# Altium schematic sheet Siwa_PCB.SchDoc
size A0; SheetNumber: 1; SheetTotal: 1
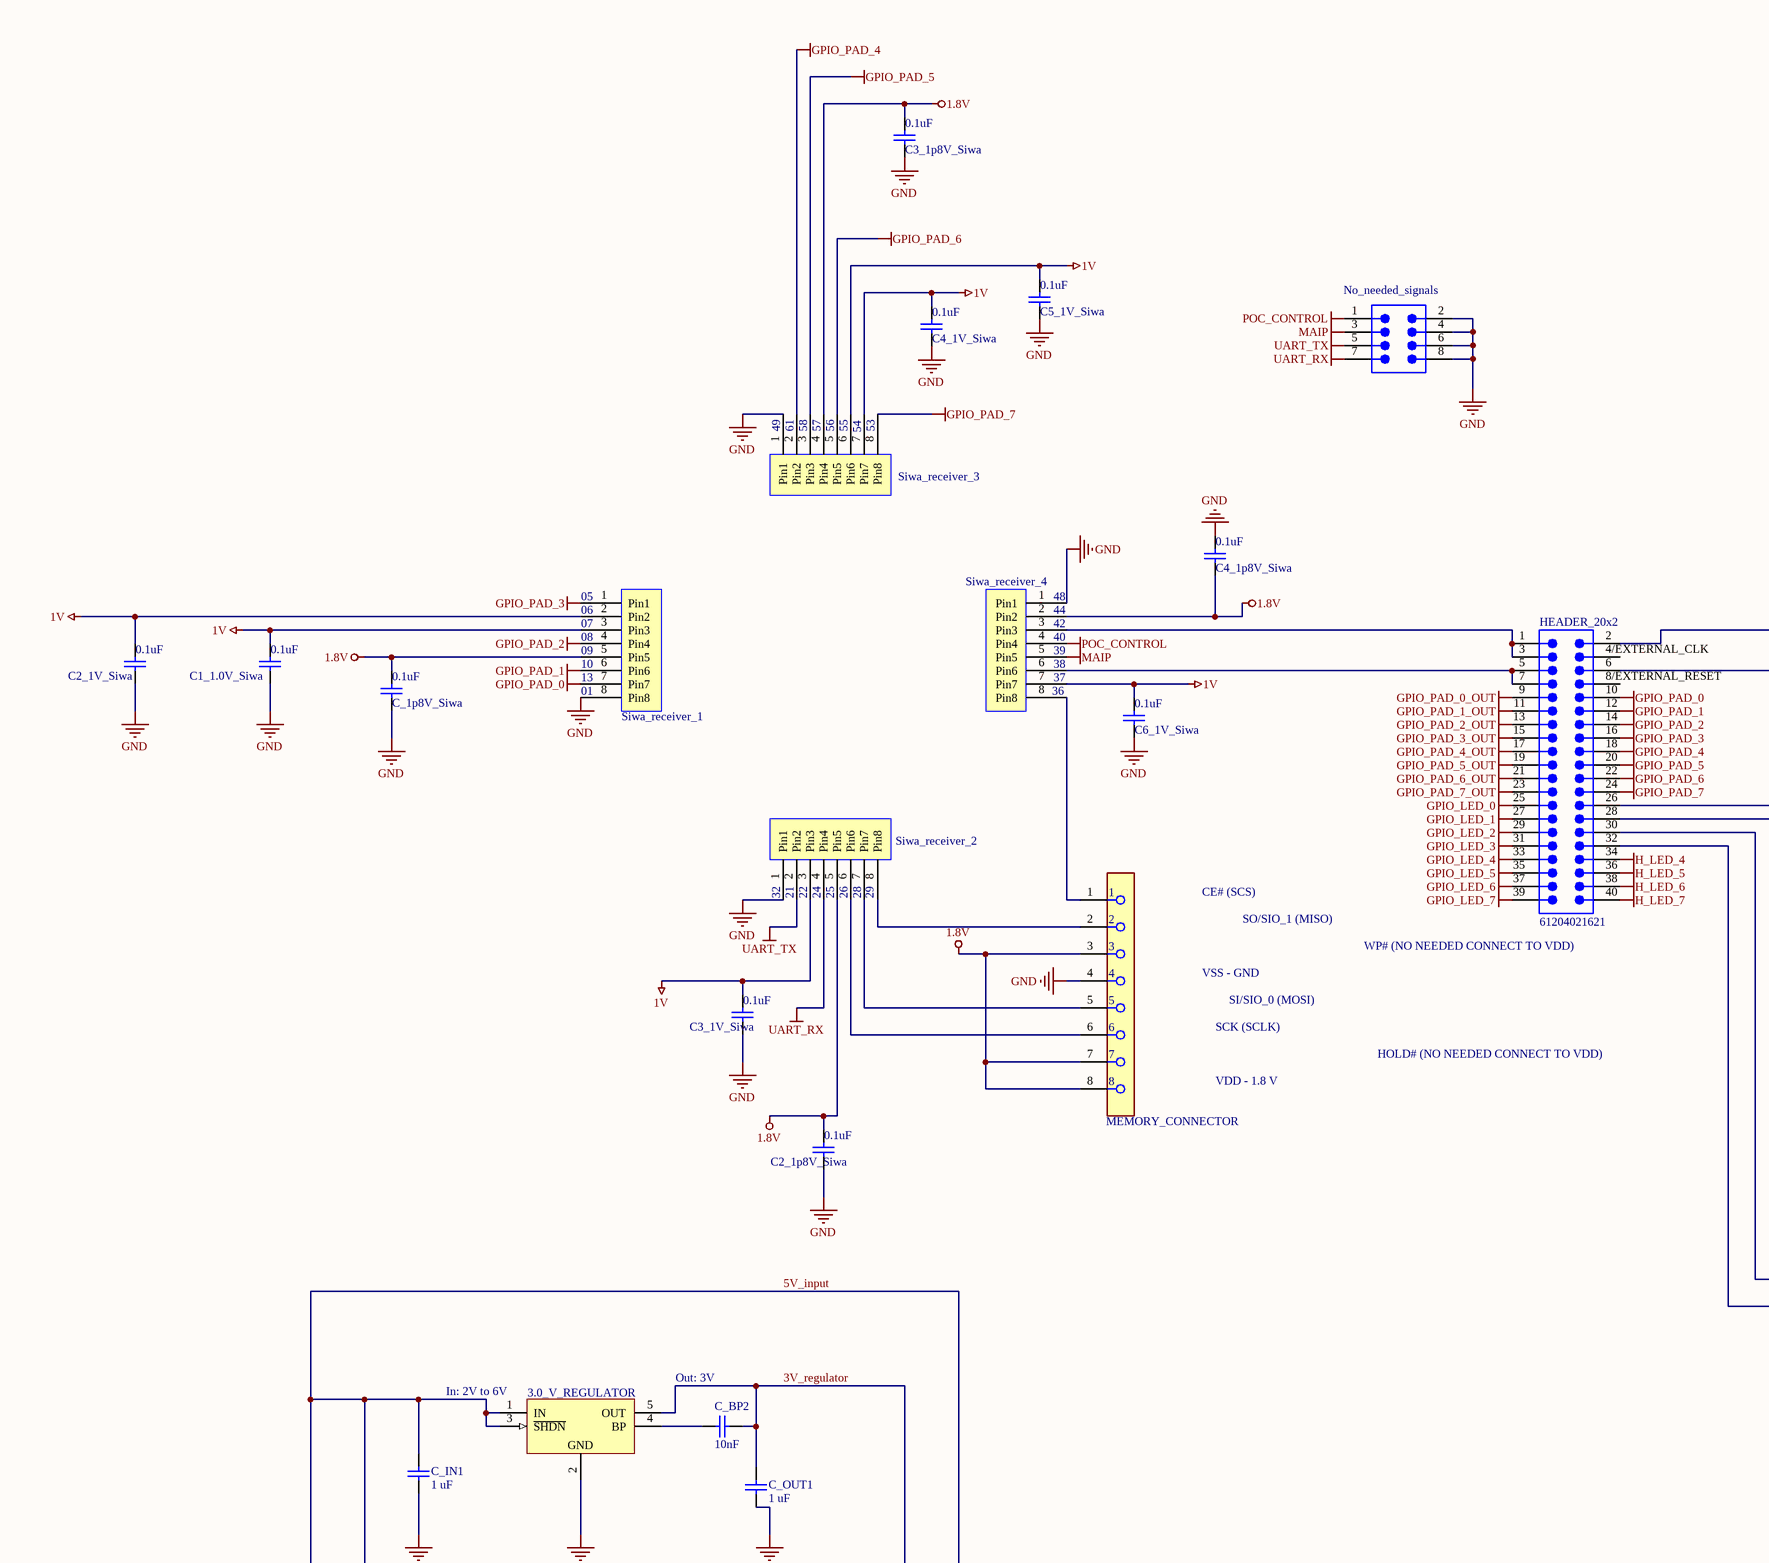
[diagram p0: Siwa_PCB.SchDoc, top left]
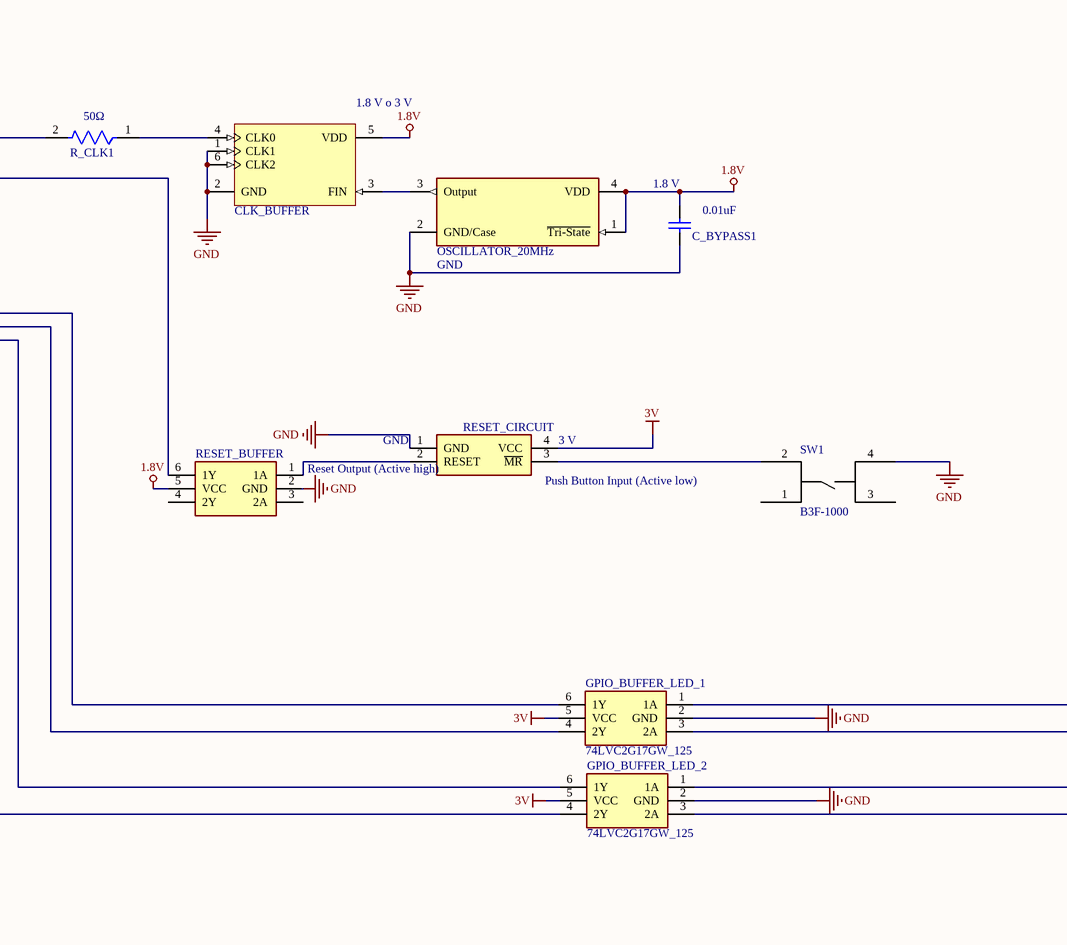
[diagram p1: Siwa_PCB.SchDoc, top right]
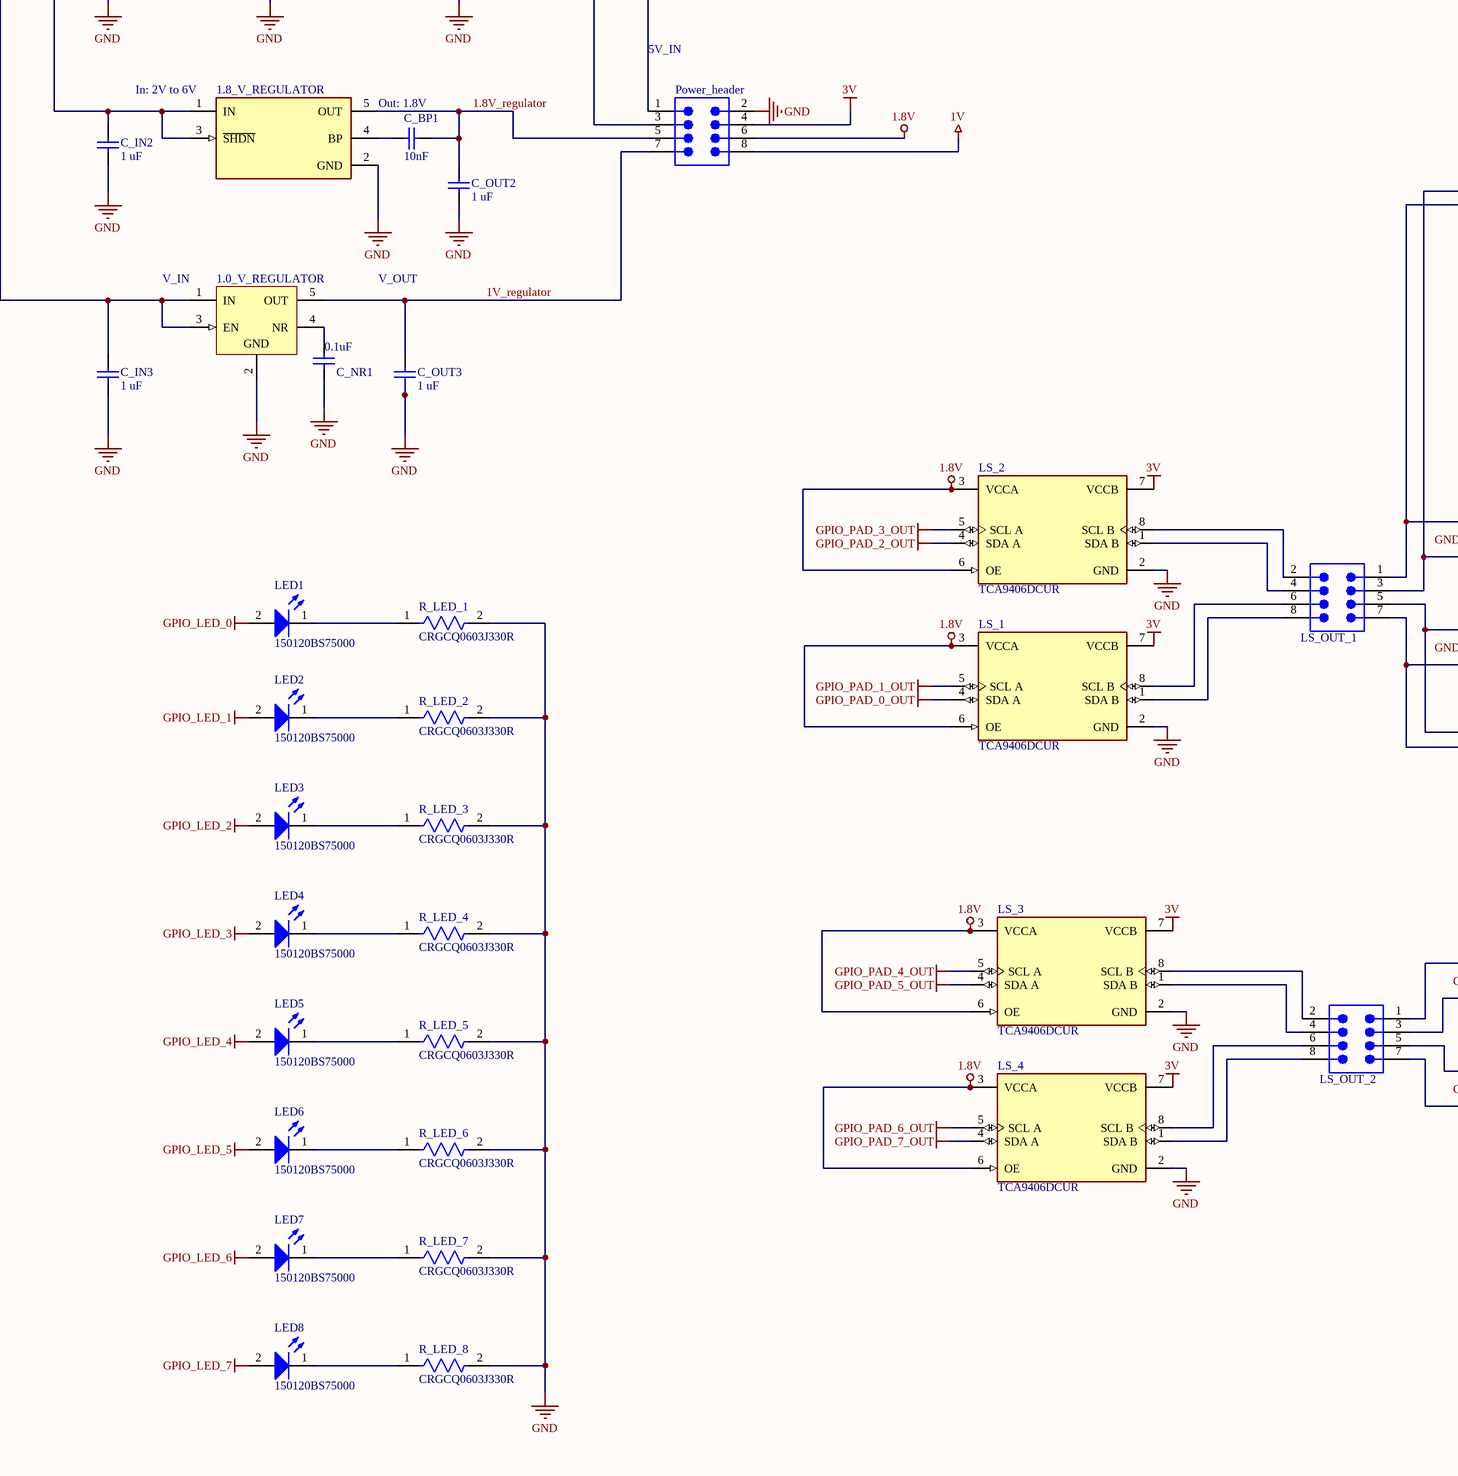
[diagram p2: Siwa_PCB.SchDoc, bottom left]
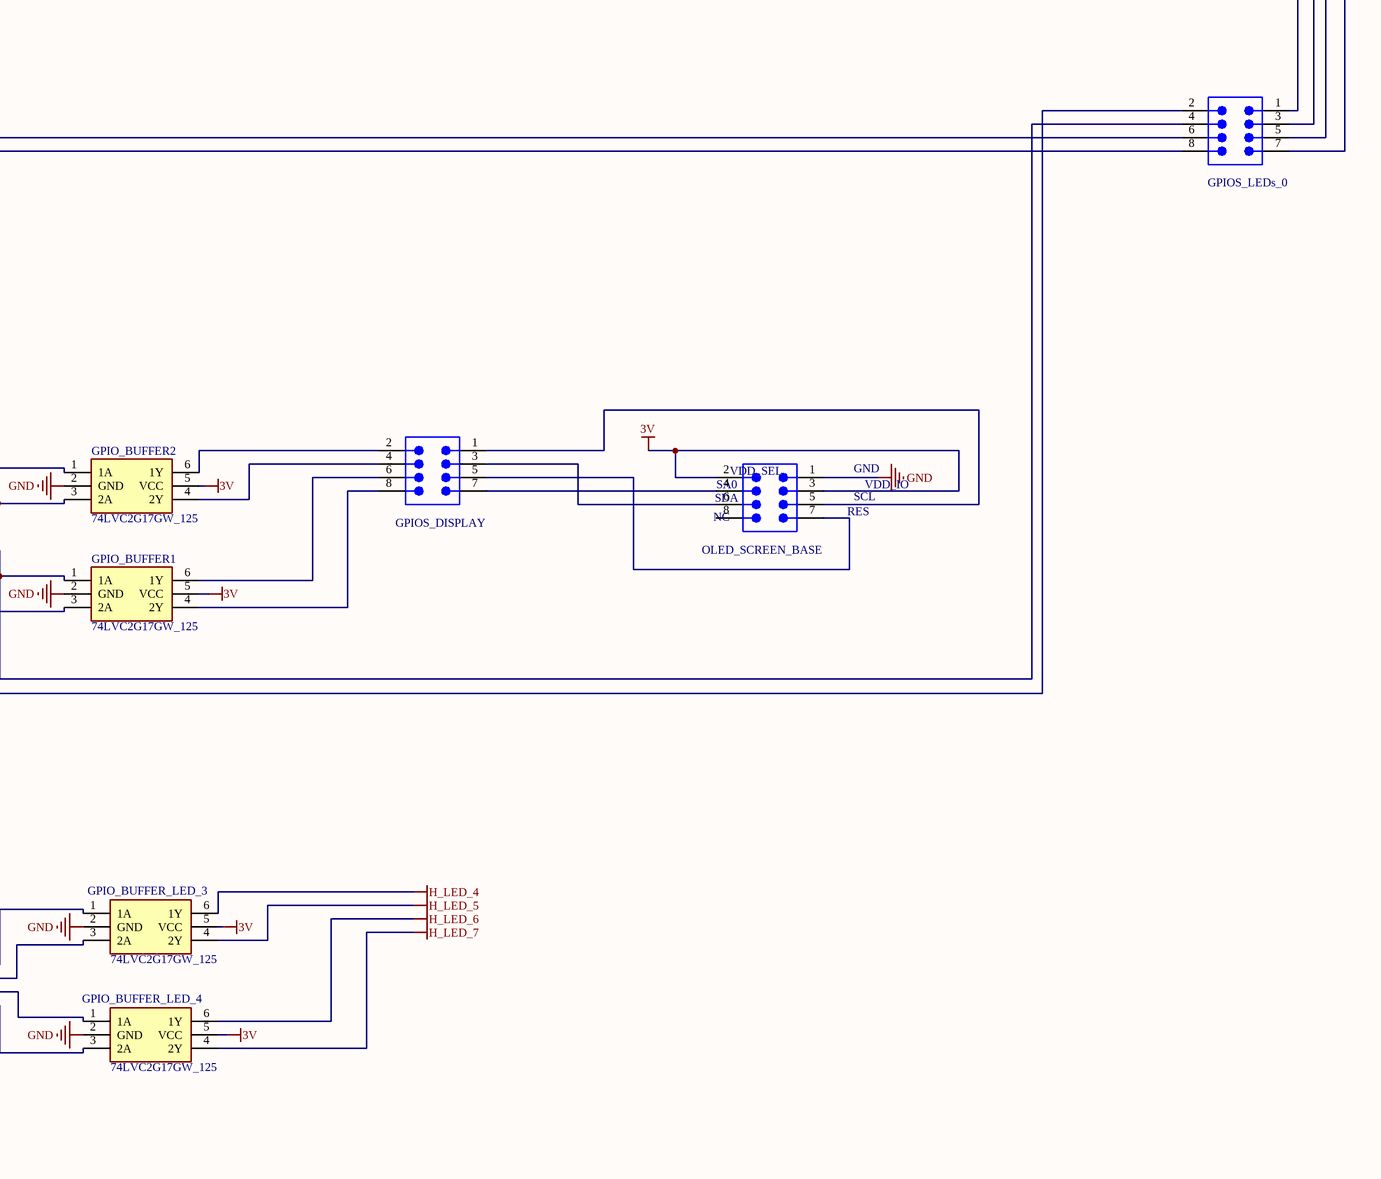
[diagram p3: Siwa_PCB.SchDoc, bottom right]

## Parts
1.0_V_REGULATOR  TPS71710DCKT  [DCK0005A_M]  (value not drawn)
1.8_V_REGULATOR  MAX8510EXK18+T  [FP-X5-1-MFG]  (value not drawn)
3.0_V_REGULATOR  MAX8510EXK30+T  [X5-1_N]  (value not drawn)
C1_1.0V_Siwa  0.1uF  [CAPC1608X92X38NL15T08]
C2_1p8V_Siwa  0.1uF  [CAPC1608X92X38NL15T08]
C2_1V_Siwa  0.1uF  [CAPC1608X92X38NL15T08]
C3_1p8V_Siwa  0.1uF  [CAPC1608X92X38NL15T08]
C3_1V_Siwa  0.1uF  [CAPC1608X92X38NL15T08]
C4_1p8V_Siwa  0.1uF  [CAPC1608X92X38NL15T08]
C4_1V_Siwa  0.1uF  [CAPC1608X92X38NL15T08]
C5_1V_Siwa  0.1uF  [CAPC1608X92X38NL15T08]
C6_1V_Siwa  0.1uF  [CAPC1608X92X38NL15T08]
C_1p8V_Siwa  0.1uF  [CAPC1608X92X38NL15T08]
C_BP1  10nF  [CAPC1608X92X38LL15T08]
C_BP2  10nF  [CAPC1608X92X38LL15T08]
C_BYPASS1  0.01uF  [CAPC1608X92X38NL15T08]
C_IN1  1 uF  [CAPC1608X90X35LL15T15]
C_IN2  1 uF  [CAPC1608X90X35LL15T15]
C_IN3  1 uF  [CAPC1608X90X35LL15T15]
C_NR1  0.1uF  [CAPC1608X92X38NL15T08]
C_OUT1  1 uF  [CAPC1608X90X35LL15T15]
C_OUT2  1 uF  [CAPC1608X90X35LL15T15]
C_OUT3  1 uF  [CAPC1608X90X35LL15T15]
CLK_BUFFER  PL133-37TI  [FP-SOT23-6LD-PL-1-MFG]  (value not drawn)
GPIO_BUFFER1  74LVC2G17GW_125  [SOT65P210X110-6N]
GPIO_BUFFER2  74LVC2G17GW_125  [SOT65P210X110-6N]
GPIO_BUFFER_LED_1  74LVC2G17GW_125  [SOT65P210X110-6N]
GPIO_BUFFER_LED_2  74LVC2G17GW_125  [SOT65P210X110-6N]
GPIO_BUFFER_LED_3  74LVC2G17GW_125  [SOT65P210X110-6N]
GPIO_BUFFER_LED_4  74LVC2G17GW_125  [SOT65P210X110-6N]
GPIOS_DISPLAY  61200821621  [61200821621]  (value not drawn)
GPIOS_LEDs_0  61200821621  [61200821621]  (value not drawn)
HEADER_20x2  61204021621  [61204021621]
LED1  150120BS75000  [WL-SMCW_1206_150120xx75000]
LED2  150120BS75000  [WL-SMCW_1206_150120xx75000]
LED3  150120BS75000  [WL-SMCW_1206_150120xx75000]
LED4  150120BS75000  [WL-SMCW_1206_150120xx75000]
LED5  150120BS75000  [WL-SMCW_1206_150120xx75000]
LED6  150120BS75000  [WL-SMCW_1206_150120xx75000]
LED7  150120BS75000  [WL-SMCW_1206_150120xx75000]
LED8  150120BS75000  [WL-SMCW_1206_150120xx75000]
LS_1  TCA9406DCUR  [FP-DCU0008A-IPC_B]
LS_2  TCA9406DCUR  [FP-DCU0008A-IPC_B]
LS_3  TCA9406DCUR  [FP-DCU0008A-IPC_B]
LS_4  TCA9406DCUR  [FP-DCU0008A-IPC_B]
LS_OUT_1  61200821621  [61200821621]  (value not drawn)
LS_OUT_2  61200821621  [61200821621]  (value not drawn)
MEMORY_CONNECTOR  DIP8_base  [FP-1-2199298-2-MFG]  (value not drawn)
No_needed_signals  61200821621  [61200821621]  (value not drawn)
OLED_SCREEN_BASE  61200821621  [61200821621]  (value not drawn)
OSCILLATOR_20MHz  ASE3-20.000MHZ-KT  [FP-ASE3-MFG]  (value not drawn)
Power_header  61200821621  [61200821621]  (value not drawn)
R_CLK1  50Ω  [FP-D12-CRCW0805-MFG]
R_LED_1  CRGCQ0603J330R  [FP-CRGCQ0603-IPC_C]
R_LED_2  CRGCQ0603J330R  [FP-CRGCQ0603-IPC_C]
R_LED_3  CRGCQ0603J330R  [FP-CRGCQ0603-IPC_C]
R_LED_4  CRGCQ0603J330R  [FP-CRGCQ0603-IPC_C]
R_LED_5  CRGCQ0603J330R  [FP-CRGCQ0603-IPC_C]
R_LED_6  CRGCQ0603J330R  [FP-CRGCQ0603-IPC_C]
R_LED_7  CRGCQ0603J330R  [FP-CRGCQ0603-IPC_C]
R_LED_8  CRGCQ0603J330R  [FP-CRGCQ0603-IPC_C]
RESET_BUFFER  74LVC2G17GW_125  [SOT65P210X110-6N]  (value not drawn)
RESET_CIRCUIT  APX812-29UG-7  [APX81229UG7]  (value not drawn)
Siwa_receiver_1  HEADER 8P 2.54mm  [PPTC081LFBN-RC]  (value not drawn)
Siwa_receiver_2  HEADER 8P 2.54mm  [PPTC081LFBN-RC]  (value not drawn)
Siwa_receiver_3  HEADER 8P 2.54mm  [PPTC081LFBN-RC]  (value not drawn)
Siwa_receiver_4  HEADER 8P 2.54mm  [PPTC081LFBN-RC]  (value not drawn)
SW1  B3F-1000  [PCBComponent_1]

## Nets
1.8V: C2_1p8V_Siwa.2 C3_1p8V_Siwa.2 C4_1p8V_Siwa.1 C_1p8V_Siwa.2 C_BYPASS1.2 CLK_BUFFER.5(VDD) LS_1.3(VCCA) LS_1.6(OE) LS_2.3(VCCA) LS_2.6(OE) LS_3.3(VCCA) LS_3.6(OE) LS_4.3(VCCA) LS_4.6(OE) MEMORY_CONNECTOR.3 MEMORY_CONNECTOR.7 MEMORY_CONNECTOR.8 OSCILLATOR_20MHz.1(~{Tri-State}) OSCILLATOR_20MHz.4(VDD) Power_header.6 RESET_BUFFER.5(VCC) Siwa_receiver_1.5(Pin5) Siwa_receiver_2.5(Pin5) Siwa_receiver_3.4(Pin4) Siwa_receiver_4.2(Pin2)
1V: C1_1.0V_Siwa.2 C2_1V_Siwa.2 C3_1V_Siwa.2 C4_1V_Siwa.2 C5_1V_Siwa.2 C6_1V_Siwa.2 Power_header.8 Siwa_receiver_1.2(Pin2) Siwa_receiver_1.3(Pin3) Siwa_receiver_2.3(Pin3) Siwa_receiver_3.6(Pin6) Siwa_receiver_3.7(Pin7) Siwa_receiver_4.7(Pin7)
3V: GPIO_BUFFER1.5(VCC) GPIO_BUFFER2.5(VCC) GPIO_BUFFER_LED_1.5(VCC) GPIO_BUFFER_LED_2.5(VCC) GPIO_BUFFER_LED_3.5(VCC) GPIO_BUFFER_LED_4.5(VCC) LS_1.7(VCCB) LS_2.7(VCCB) LS_3.7(VCCB) LS_4.7(VCCB) OLED_SCREEN_BASE.2 OLED_SCREEN_BASE.3 Power_header.4 RESET_CIRCUIT.4(VCC)
GND: 1.0_V_REGULATOR.2(GND) 1.8_V_REGULATOR.2(GND) 3.0_V_REGULATOR.2(GND) C1_1.0V_Siwa.1 C2_1p8V_Siwa.1 C2_1V_Siwa.1 C3_1p8V_Siwa.1 C3_1V_Siwa.1 C4_1p8V_Siwa.2 C4_1V_Siwa.1 C5_1V_Siwa.1 C6_1V_Siwa.1 C_1p8V_Siwa.1 C_BYPASS1.1 C_IN1.1 C_IN2.1 C_IN3.1 C_NR1.1 C_OUT1.1 C_OUT2.1 C_OUT3.1 CLK_BUFFER.1(CLK1) CLK_BUFFER.2(GND) CLK_BUFFER.6(CLK2) GPIO_BUFFER1.2(GND) GPIO_BUFFER2.2(GND) GPIO_BUFFER_LED_1.2(GND) GPIO_BUFFER_LED_2.2(GND) GPIO_BUFFER_LED_3.2(GND) GPIO_BUFFER_LED_4.2(GND) LS_1.2(GND) LS_2.2(GND) LS_3.2(GND) LS_4.2(GND) MEMORY_CONNECTOR.4 No_needed_signals.2 No_needed_signals.4 No_needed_signals.6 No_needed_signals.8 OLED_SCREEN_BASE.1 OSCILLATOR_20MHz.2(GND/Case) Power_header.2 R_LED_1.2 R_LED_2.2 R_LED_3.2 R_LED_4.2 R_LED_5.2 R_LED_6.2 R_LED_7.2 R_LED_8.2 RESET_BUFFER.2(GND) RESET_CIRCUIT.1(GND) Siwa_receiver_1.8(Pin8) Siwa_receiver_2.1(Pin1) Siwa_receiver_3.1(Pin1) Siwa_receiver_4.1(Pin1) SW1.4(P4)
GPIO_LED_0: HEADER_20x2.25 LED1.2(A)
GPIO_LED_1: HEADER_20x2.27 LED2.2(A)
GPIO_LED_2: HEADER_20x2.29 LED3.2(A)
GPIO_LED_3: HEADER_20x2.31 LED4.2(A)
GPIO_LED_4: HEADER_20x2.33 LED5.2(A)
GPIO_LED_5: HEADER_20x2.35 LED6.2(A)
GPIO_LED_6: HEADER_20x2.37 LED7.2(A)
GPIO_LED_7: HEADER_20x2.39 LED8.2(A)
GPIO_PAD_0: HEADER_20x2.10 Siwa_receiver_1.7(Pin7)
GPIO_PAD_0_OUT: HEADER_20x2.9 LS_1.4(SDA_A)
GPIO_PAD_1: HEADER_20x2.12 Siwa_receiver_1.6(Pin6)
GPIO_PAD_1_OUT: HEADER_20x2.11 LS_1.5(SCL_A)
GPIO_PAD_2: HEADER_20x2.14 Siwa_receiver_1.4(Pin4)
GPIO_PAD_2_OUT: HEADER_20x2.13 LS_2.4(SDA_A)
GPIO_PAD_3: HEADER_20x2.16 Siwa_receiver_1.1(Pin1)
GPIO_PAD_3_OUT: HEADER_20x2.15 LS_2.5(SCL_A)
GPIO_PAD_4: HEADER_20x2.18 Siwa_receiver_3.2(Pin2)
GPIO_PAD_4_OUT: HEADER_20x2.17 LS_3.5(SCL_A)
GPIO_PAD_5: HEADER_20x2.20 Siwa_receiver_3.3(Pin3)
GPIO_PAD_5_OUT: HEADER_20x2.19 LS_3.4(SDA_A)
GPIO_PAD_6: HEADER_20x2.22 Siwa_receiver_3.5(Pin5)
GPIO_PAD_6_OUT: HEADER_20x2.21 LS_4.5(SCL_A)
GPIO_PAD_7: HEADER_20x2.24 Siwa_receiver_3.8(Pin8)
GPIO_PAD_7_OUT: HEADER_20x2.23 LS_4.4(SDA_A)
H_LED_4: GPIO_BUFFER_LED_3.6(1Y) HEADER_20x2.34
H_LED_5: GPIO_BUFFER_LED_3.4(2Y) HEADER_20x2.36
H_LED_6: GPIO_BUFFER_LED_4.6(1Y) HEADER_20x2.38
H_LED_7: GPIO_BUFFER_LED_4.4(2Y) HEADER_20x2.40
MAIP: No_needed_signals.3 Siwa_receiver_4.5(Pin5)
POC_CONTROL: No_needed_signals.1 Siwa_receiver_4.4(Pin4)
UART_RX: No_needed_signals.7 Siwa_receiver_2.4(Pin4)
UART_TX: No_needed_signals.5 Siwa_receiver_2.2(Pin2)
1.8V_regulator: 1.8_V_REGULATOR.5(OUT) C_BP1.2 C_OUT2.2 Power_header.5
1V_regulator: 1.0_V_REGULATOR.5(OUT) C_OUT3.2 Power_header.7
3V_regulator: 3.0_V_REGULATOR.5(OUT) C_BP2.2 C_OUT1.2 Power_header.3
5V_input: 1.0_V_REGULATOR.1(IN) 1.0_V_REGULATOR.3(EN) 1.8_V_REGULATOR.1(IN) 1.8_V_REGULATOR.3(~{SHDN}) 3.0_V_REGULATOR.1(IN) 3.0_V_REGULATOR.3(~{SHDN}) C_IN1.2 C_IN2.2 C_IN3.2 Power_header.1
Net1.0_V_REGULATOR_4: 1.0_V_REGULATOR.4(NR) C_NR1.2
Net1.8_V_REGULATOR_4: 1.8_V_REGULATOR.4(BP) C_BP1.1
Net3.0_V_REGULATOR_4: 3.0_V_REGULATOR.4(BP) C_BP2.1
NetCLK_BUFFER_3: CLK_BUFFER.3(FIN) OSCILLATOR_20MHz.3(Output)
NetCLK_BUFFER_4: CLK_BUFFER.4(CLK0) R_CLK1.1
NetGPIO_BUFFER1_1: GPIO_BUFFER1.1(1A) GPIOS_LEDs_0.4 LS_OUT_1.5
NetGPIO_BUFFER1_3: GPIO_BUFFER1.3(2A) GPIOS_LEDs_0.2 LS_OUT_1.7
NetGPIO_BUFFER1_4: GPIO_BUFFER1.4(2Y) GPIOS_DISPLAY.8
NetGPIO_BUFFER1_6: GPIO_BUFFER1.6(1Y) GPIOS_DISPLAY.6
NetGPIO_BUFFER2_1: GPIO_BUFFER2.1(1A) GPIOS_LEDs_0.8 LS_OUT_1.1
NetGPIO_BUFFER2_3: GPIO_BUFFER2.3(2A) GPIOS_LEDs_0.6 LS_OUT_1.3
NetGPIO_BUFFER2_4: GPIO_BUFFER2.4(2Y) GPIOS_DISPLAY.4
NetGPIO_BUFFER2_6: GPIO_BUFFER2.6(1Y) GPIOS_DISPLAY.2
NetGPIO_BUFFER_LED_1_1: GPIO_BUFFER_LED_1.1(1A) GPIOS_LEDs_0.1
NetGPIO_BUFFER_LED_1_3: GPIO_BUFFER_LED_1.3(2A) GPIOS_LEDs_0.3
NetGPIO_BUFFER_LED_1_4: GPIO_BUFFER_LED_1.4(2Y) HEADER_20x2.28
NetGPIO_BUFFER_LED_1_6: GPIO_BUFFER_LED_1.6(1Y) HEADER_20x2.26
NetGPIO_BUFFER_LED_2_1: GPIO_BUFFER_LED_2.1(1A) GPIOS_LEDs_0.5
NetGPIO_BUFFER_LED_2_3: GPIO_BUFFER_LED_2.3(2A) GPIOS_LEDs_0.7
NetGPIO_BUFFER_LED_2_4: GPIO_BUFFER_LED_2.4(2Y) HEADER_20x2.32
NetGPIO_BUFFER_LED_2_6: GPIO_BUFFER_LED_2.6(1Y) HEADER_20x2.30
NetGPIO_BUFFER_LED_3_1: GPIO_BUFFER_LED_3.1(1A) LS_OUT_2.1
NetGPIO_BUFFER_LED_3_3: GPIO_BUFFER_LED_3.3(2A) LS_OUT_2.3
NetGPIO_BUFFER_LED_4_1: GPIO_BUFFER_LED_4.1(1A) LS_OUT_2.5
NetGPIO_BUFFER_LED_4_3: GPIO_BUFFER_LED_4.3(2A) LS_OUT_2.7
NetGPIOS_DISPLAY_1: GPIOS_DISPLAY.1 OLED_SCREEN_BASE.5
NetGPIOS_DISPLAY_3: GPIOS_DISPLAY.3 OLED_SCREEN_BASE.6
NetGPIOS_DISPLAY_5: GPIOS_DISPLAY.5 OLED_SCREEN_BASE.7
NetGPIOS_DISPLAY_7: GPIOS_DISPLAY.7 OLED_SCREEN_BASE.4
NetHEADER_20x2_1: HEADER_20x2.1 HEADER_20x2.3 Siwa_receiver_4.3(Pin3)
NetHEADER_20x2_2: HEADER_20x2.2 R_CLK1.2
NetHEADER_20x2_5: HEADER_20x2.5 HEADER_20x2.7 Siwa_receiver_4.6(Pin6)
NetHEADER_20x2_6: HEADER_20x2.6 RESET_BUFFER.6(1Y)
NetLED1_1: LED1.1(K) R_LED_1.1
NetLED2_1: LED2.1(K) R_LED_2.1
NetLED3_1: LED3.1(K) R_LED_3.1
NetLED4_1: LED4.1(K) R_LED_4.1
NetLED5_1: LED5.1(K) R_LED_5.1
NetLED6_1: LED6.1(K) R_LED_6.1
NetLED7_1: LED7.1(K) R_LED_7.1
NetLED8_1: LED8.1(K) R_LED_8.1
NetLS_1_1: LS_1.1(SDA_B) LS_OUT_1.8
NetLS_1_8: LS_1.8(SCL_B) LS_OUT_1.6
NetLS_2_1: LS_2.1(SDA_B) LS_OUT_1.4
NetLS_2_8: LS_2.8(SCL_B) LS_OUT_1.2
NetLS_3_1: LS_3.1(SDA_B) LS_OUT_2.4
NetLS_3_8: LS_3.8(SCL_B) LS_OUT_2.2
NetLS_4_1: LS_4.1(SDA_B) LS_OUT_2.8
NetLS_4_8: LS_4.8(SCL_B) LS_OUT_2.6
NetMEMORY_CONNECTOR_1: MEMORY_CONNECTOR.1 Siwa_receiver_4.8(Pin8)
NetMEMORY_CONNECTOR_2: MEMORY_CONNECTOR.2 Siwa_receiver_2.8(Pin8)
NetMEMORY_CONNECTOR_5: MEMORY_CONNECTOR.5 Siwa_receiver_2.7(Pin7)
NetMEMORY_CONNECTOR_6: MEMORY_CONNECTOR.6 Siwa_receiver_2.6(Pin6)
NetRESET_BUFFER_1: RESET_BUFFER.1(1A) RESET_CIRCUIT.2(RESET)
NetRESET_CIRCUIT_3: RESET_CIRCUIT.3(~{MR}) SW1.2(P2)

Not connected (* = marked no-connect by the designer): HEADER_20x2 4/EXTERNAL_CLK(4) 8/EXTERNAL_RESET(8); OLED_SCREEN_BASE 8; RESET_BUFFER 3(2A) 4(2Y); SW1 1(P1) 3(P3)

## Notes on the sheet
- (near Siwa_receiver_3) 49
- (near Siwa_receiver_3) 61
- (near Siwa_receiver_3) 58
- (near Siwa_receiver_3) 57
- (near Siwa_receiver_3) 56
- (near Siwa_receiver_3) 55
- (near Siwa_receiver_3) 54
- (near Siwa_receiver_3) 53
- (near Siwa_receiver_1) 05
- (near Siwa_receiver_4) 48
- (near CLK_BUFFER) 1.8 V o 3 V
- (near Siwa_receiver_1) 06
- (near Siwa_receiver_1) 07
- (near Siwa_receiver_1) 08
- (near Siwa_receiver_1) 09
- (near Siwa_receiver_1) 10
- (near Siwa_receiver_4) 44
- (near Siwa_receiver_4) 42
- (near Siwa_receiver_4) 40
- (near Siwa_receiver_4) 39
- (near Siwa_receiver_4) 38
- (near Siwa_receiver_1) 13
- (near Siwa_receiver_1) 01
- (near Siwa_receiver_4) 36
- (near Siwa_receiver_4) 37
- 1.8 V
- (near OSCILLATOR_20MHz) GND
- (near Siwa_receiver_2) 32
- (near Siwa_receiver_2) 21
- (near Siwa_receiver_2) 22
- (near Siwa_receiver_2) 24
- (near Siwa_receiver_2) 25
- (near Siwa_receiver_2) 26
- (near Siwa_receiver_2) 28
- (near Siwa_receiver_2) 29
- (near MEMORY_CONNECTOR) CE# (SCS)
- (near MEMORY_CONNECTOR) SO/SIO_1 (MISO)
- (near RESET_CIRCUIT) GND
- (near RESET_CIRCUIT) 3 V
- (near MEMORY_CONNECTOR) VSS - GND
- (near MEMORY_CONNECTOR) SI/SIO_0 (MOSI)
- WP# (NO NEEDED CONNECT TO VDD)
- (near RESET_CIRCUIT) Reset Output (Active high)
- (near RESET_CIRCUIT) Push Button Input (Active low)
- (near MEMORY_CONNECTOR) SCK (SCLK)
- HOLD# (NO NEEDED CONNECT TO VDD)
- (near MEMORY_CONNECTOR) VDD - 1.8 V
- (near 3.0_V_REGULATOR) In: 2V to 6V
- Out: 3V
- 5V_IN
- (near 1.8_V_REGULATOR) In: 2V to 6V
- Out: 1.8V
- (near 1.0_V_REGULATOR) V_IN
- V_OUT
- (near OLED_SCREEN_BASE) SDA
- (near OLED_SCREEN_BASE) SA0
- (near OLED_SCREEN_BASE) VDD_SEL
- (near OLED_SCREEN_BASE) GND
- (near OLED_SCREEN_BASE) SCL
- (near OLED_SCREEN_BASE) VDD_IO
- (near OLED_SCREEN_BASE) NC
- (near OLED_SCREEN_BASE) RES

## Library data of the parts
1.0_V_REGULATOR = CMP-0394-00843-2: Single Output High PSRR LDO, 150 mA, Fixed 1 V Output, 2.5 to 6.5 V Input, with Low IQ, 5-pin SC70 (DCK), -40 to 85 degC, Green (RoHS & no Sb/Br); Manufacturer: Texas Instruments; Fixed Output Options(V): 1; Iq(Typ)(mA): 0.05; Vdo(Typ)(mV): 170; Vin(Min)(V): 2.5; Vin(Max)(V): 6.5; Iout(Max)(A): 0.15; Accuracy(%): 3; SubFamily: Single Channel LDO; PackageReference: DCK0005A; Mounting Technology: Surface Mount; Vout Adj(Max)(V): 1; Eco-Plan: Green (RoHS & no Sb/Br); Vout Adj(Min)(V): 1; ComponentLink1URL: http://www.ti.com/; ComponentLink1Description: Manufacturer URL; ComponentLink2URL: http://www.ti.com/general/docs/lit/getliterature.tsp?genericPartNumber=TPS71710&fileType=pdf; ComponentLink3Description: Package Specification; ComponentLink3URL: http://www.ti.com/litv/pdf/mpds025f; Code_JEDEC: MO-203; DatasheetVersion: SBVS068G; ComponentLink2Description: Datasheet; PackageVersion: 4093553-3/G; PackageDescription: 5-Pin Plastic Small-Outline, Body 2 x 1.25 mm, Pitch 0.65 mm; PartNumber: TPS71710DCKT
1.8_V_REGULATOR = CMP-0246-00401-2: IC REG LINEAR 1.8V 120MA SC70-5; Accuracy: 2%; Number of Outputs: 1; Min Current Limit: 130mA; Max Input Voltage: 6V; Max Power Dissipation: 247mW; Output Configuration: Positive; Output Type: Fixed; Quiescent Current: 90uA; Reference Voltage: 1.225V; Min Input Voltage: 2V; Power Supply Rejection Ratio (PSRR): 54dB; Input Bias Current: 40uA; Output Current: 120mA; Nominal Output Voltage: 1.8V; Output Voltage: 1.8V; Series: -; Number of Regulators: 1; Packaging: Tape and Reel; Mount: Surface Mount; Case/Package: SC; Lead Free: Lead Free; RoHS Compliant: Yes; Number of Pins: 5; Package Quantity: 2500; Max Output Current: 120mA; Polarity: Positive; Min Operating Temperature: -40°C; Max Operating Temperature: 85°C
3.0_V_REGULATOR = CMP-0246-00522-1: Ultra-Low-Noise, High PSRR, Low-Dropout, 120mA Linear Regulator, 3V Out, 5-Pin SC70, -40°C to +85°C; ComponentLink1Description: Manufacturer URL; ComponentLink2URL: http://datasheets.maxim-ic.com/en/ds/MAX8510-MAX8512.pdf; PackageDescription: 5-Pin SC70 Transistor Package, 0.65 mm Pitch, 2.2 mm Lead Span; ComponentLink3Description: Package Specification; ComponentLink1URL: http://www.maxim-ic.com; ComponentLink3URL: http://pdfserv.maxim-ic.com/package_dwgs/21-0076.PDF; PackageVersion: revE, 2006; PackageReference: X5-1; Code_JEDEC: MO-203; ComponentLink2Description: Datasheet; DatasheetVersion: Rev 4, Aug-2011
C1_1.0V_Siwa C2_1p8V_Siwa C2_1V_Siwa C3_1p8V_Siwa C3_1V_Siwa C4_1p8V_Siwa C4_1V_Siwa C5_1V_Siwa C6_1V_Siwa C_1p8V_Siwa C_NR1 = CMP-2006-01166-1: Manufacturer: Vitramon; Part Number: VJ0603Y104KXXAP
C_BP1 C_BP2 = CMP-2006-01201-1: Manufacturer: Vitramon; Part Number: VJ0603Y103JXXAC
C_BYPASS1 = CMP-2006-01149-1: Manufacturer: Vitramon; Part Number: VJ0603Y103KXAAP
C_IN1-C_IN3 C_OUT1-C_OUT3 = CMP-2006-04542-1: Manufacturer: AVX Interconnect / Elco; Part Number: 0603YG105ZAT2A
CLK_BUFFER = CMP-00252-66952958-1: PL133-37TI LVCMOS Sine Wave PL133 SOT-23-6 R-PDSO-G6 clock driver 0.95mm 1.62V~3.63V 150MHz -40C~85C; Number of Circuits: 1; Logic Function: Inverting; Min Supply Voltage: 1.62V; Max Supply Voltage: 3.63V; Number of Outputs: 3; Lifecycle Status: Production; Max Frequency: 150MHz; Schedule B: 8542390000, 8542390000; Mount: Surface Mount; Max Operating Temperature: 85°C; Number of Elements: 1; Lead Free: Lead Free; RoHS: Compliant; Min Operating Temperature: -40°C; Number of Inputs: 1; Input: LVCMOS; Height: 1.45mm
GPIO_BUFFER1 GPIO_BUFFER2 GPIO_BUFFER_LED_1-GPIO_BUFFER_LED_4 RESET_BUFFER = 74LVC2G17GW_125: NXP 74LVC2G17GW,125, Dual Non-Inverting Schmitt Trigger Single Ended Buffer, 1.65  5.5 V, 6-Pin SC-88; Manufacturer_Name: Nexperia; Geometry.Height: 1.1mm; Manufacturer_Part_Number: 74LVC2G17GW,125; Mouser Part Number: 771-LVC2G17GW125; Mouser Price/Stock: https://www.mouser.co.uk/ProductDetail/Nexperia/74LVC2G17GW125?qs=me8TqzrmIYUC6E0%2FnH98oA%3D%3D; Arrow Part Number: 74LVC2G17GW,125; Arrow Price/Stock: https://www.arrow.com/en/products/74lvc2g17gw125/nexperia?utm_currency=USD&region=nac; Datasheet Link: https://assets.nexperia.com/documents/data-sheet/74LVC2G17.pdf
GPIOS_DISPLAY GPIOS_LEDs_0 LS_OUT_1 LS_OUT_2 No_needed_signals OLED_SCREEN_BASE Power_header = CMP-1502-00006-3: Wr-bhd; 2.54MM Pitch 8 Way 2 Row Shrouded Straight Pcb Header, Surface Mount; Number of Contacts: 8; Operating Supply Voltage: 250V; Gender: Male; Current Rating: 3A; Contact Resistance: 20mΩ; Connector Type: Male Pin; Insulation Resistance: 1GΩ; Pitch: 2.54mm; RoHS: Compliant; Row Spacing: 2.54mm; Color: Black; Termination: Solder; Min Operating Temperature: -40°C; Number of Rows: 2; Number of Positions: 8; Contact Material: Copper; Orientation: Vertical; Number of Pins: 8; Contact Plating: Gold; Insulation Material: PBT; Lead Pitch: 2.54mm; Length: 17.82mm; Max Operating Temperature: 105°C; Mount: Through Hole
HEADER_20x2 = CMP-1502-00015-4: WR-BHD Straight Male, Box Header, Through Hole, 2 Rows, 40 Contacts, 2.54mm Pitch; Number of Positions: 40; Contact Resistance: 20mΩ; Current Rating: 3A; Connector Type: Male Pin; Operating Supply Voltage: 250V; Insulation Resistance: 1GΩ; Color: Black; Row Spacing: 2.54mm; Pitch: 2.54mm; RoHS: Compliant; Max Operating Temperature: 105°C; Insulation Material: PBT; Number of Pins: 40; Contact Plating: Gold; Orientation: Vertical; Voltage Rating: 250V; Number of Rows: 2; Lead Pitch: 2.54mm; Length: 58.46mm; Mount: Through Hole; Gender: Male; Number of Contacts: 40; Height: 9.25mm; Min Operating Temperature: -40°C; Contact Material: Gold; Termination: Solder; REACH SVHC: Unknown
LED1-LED8 = CMP-1426-00015-3: WL-SMCW SMT Mono-Color Chip LED Waterclear; Manufacturer Package Identifier: LED_1206; Dominant Wavelength: 470nm; Lens Style: Clear, Rectangular; Test Current: 20mA; Forward Voltage: 3.2V; Forward Current: 100mA; Peak Wavelength: 465nm; Max Reverse Voltage (DC): 5V; Viewing Angle: 140°; Color: Blue; Luminous Intensity: 145mcd; Max Operating Temperature: 85°C; Case Code (Imperial): 1206; Length: 3.2mm; Width: 1.6mm; Min Operating Temperature: -40°C; Height: 680µm; Case Code (Metric): 3216; Packaging: Tape and Reel; RoHS: Compliant; Case/Package: 1206; REACH SVHC: Unknown; Wavelength: 470nm; Mount: Surface Mount
LS_1-LS_4 = CMP-0314-00417-3: IC TRNSLTR BIDIRECTIONAL US8; Propagation Delay: 4.4ns; Min Supply Voltage: 1.65V; Low Level Output Current: 50mA; Logic Function: Translator; Data Rate: 24Mbps; Turn-On Delay Time: 260ns; Max Supply Voltage: 5.5V; Number of Channels: 2; High Level Output Current: -50mA; Output Type: Voltage; Number of Pins: 8; Weight: 0.00067oz; Lead Free: Lead Free; Case/Package: VSSOP; Packaging: Tape and Reel; REACH SVHC: No SVHC; Package Quantity: 1; Length: 2.1mm; Contact Plating: Gold; Width: 2.4mm; Radiation Hardening: No; Number of Bits: 2; Height: 0.8mm; Number of Outputs: 2; Max Operating Temperature: 85°C; Min Operating Temperature: -40°C
MEMORY_CONNECTOR = CMP-03370-000009-1: CONN IC DIP SOCKET 8POS TIN; Contact Post Length: 3inch; Number of Contacts: 8; Contact Current Rating: 1A; Contact Resistance: 20mR; Insulation Resistance: 1GR; Connector Type: Pin; Row Spacing: 0.3inch; Pitch: 2.54mm; Mating Alignment: Yes (With); RoHS Compliant: Yes; Packaging: Rail/Tube; Contact Material: Bronze; Lead Pitch: 2.54mm; Mount: Through Hole; Termination: Through Hole; Max Operating Temperature: 105°C; Flammability Rating: UL94 V-0; Package Quantity: 60; Contact Finish - Mating: TIN; ELV: Compliant; Radiation Hardening: No; Number of Rows: 2; Series: Diplomate DL; Color: Black; Number of Positions: 8; Contact Plating: Tin; Min Operating Temperature: -40°C; Lead Free: Lead Free; Length: 0.4inch; Orientation: Straight; Housing Material: PBT
OSCILLATOR_20MHz = CMP-27762-010045-1: XTAL OSC XO 20.0000MHZ CMOS SMD; Min Supply Voltage: 1.71V; Max Supply Current: 4mA; Operating Supply Voltage: 1.8V; Max Supply Voltage: 1.89V; Frequency: 20MHz; Frequency Stability: 30ppm; Load Capacitance: 15pF; Length: 3.2mm; Mount: Surface Mount; Min Operating Temperature: -10°C; Max Operating Temperature: 70°C; Series: ASE3; Height: 0.049inch; Package Quantity: 1000; Depth: 2.5mm; Case/Package: SMD/SMT; Number of Pins: 4; Lead Free: Lead Free; Width: 0.098inch; Termination: SMD/SMT; Packaging: Tape and Reel; Radiation Hardening: No
R_CLK1 = CMP-00030-21390498-1: CRCW080550R0FKTA Res Thick Film 0805 50 Ohm 1% 0.125W(1/8W) ±100ppm/C Pad SMD Automotive T/R; Temperature Coefficient: 100ppm/°C; Voltage Rating: 150V; Power Rating: 125mW; Length: 2mm; Case Code (Imperial): 0805; Height: 450µm; Contact Plating: Lead, Tin; Width: 1.25mm; Max Operating Temperature: 155°C; NexarPartId: 21390498; Case Code (Metric): 2012; Min Operating Temperature: -55°C; Tolerance: 1%; Resistance: 50Ω; Case/Package: 0805; Lead Free: Contains Lead; RoHS: Non-Compliant; Composition: Thick Film; Weight: 5.499807mg
R_LED_1-R_LED_8 = CMP-03211-002147-1: CRGCQ 0603 330R 5%; Manufacturer: TE Connectivity; Temperature Coefficient: ±100ppm/°C; Power Rating: 0.1W; Value: 330Ω; Voltage Rating: 75V; Tolerance: 0.05; Device Class L1: Passive Components; ComponentLink2URL: https://www.te.com/commerce/DocumentDelivery/DDEController?Action=showdoc&DocId=Data+Sheet%7F1773204-3%7F1%7Fpdf%7FEnglish%7FENG_DS_1773204-3_1.pdf%7F4-2176339-581; ComponentLink2Description: Datasheet; RoHS: TRUE; Category: Res; Digikey Description: CRGCQ 0603 330R 5%; Lead Free: Yes; Octopart: https://octopart.com/crgcq0603j330r-te+connectivity-91018118; Mouser Description: Res General Purpose Thick Film 0603 330 Ohm 5% 1/10W ±100ppm/°C Molded Paper T/R; Height: 0.55mm; Composition: Thick Film; Series: CRGCQ; Package: CRGCQ0603; Manufacturer Part Number: CRGCQ0603J330R; Device Class L3: Chip SMD Resistors; Resistance: 330Ω; Ambient Temperature Range High: +70°C; Temperature: -55°C to +155°C; Device Class L2: Resistors; Ipc Land Pattern Name: RESC16080X45; Temperature Range High: +155°C; Temperature Range Low: -55°C
RESET_CIRCUIT = APX812-29UG-7: Supervisor Push-Pull, Totem Pole 1 Channel SOT-143 , 2.93V , 140ms , -40C ~ 85C (TA); Manufacturer_Name: Diodes Incorporated; Geometry.Height: 1.1mm; Manufacturer_Part_Number: APX812-29UG-7; Mouser Part Number: 621-APX812-29UG-7; Mouser Price/Stock: https://www.mouser.co.uk/ProductDetail/Diodes-Incorporated/APX812-29UG-7?qs=uwE%252BXfKqZqTVBV%252BbZr8J2A%3D%3D; Arrow Part Number: APX812-29UG-7; Arrow Price/Stock: https://www.arrow.com/en/products/apx812-29ug-7/diodes-incorporated; Datasheet Link: https://www.diodes.com//assets/Datasheets/APX811_812.pdf
Siwa_receiver_1-Siwa_receiver_4 = PPTC081LFBN-RC
SW1 = B3F-1000S